# EAGLE schematic Tracker_V3 (EAGLE 9.6.2)
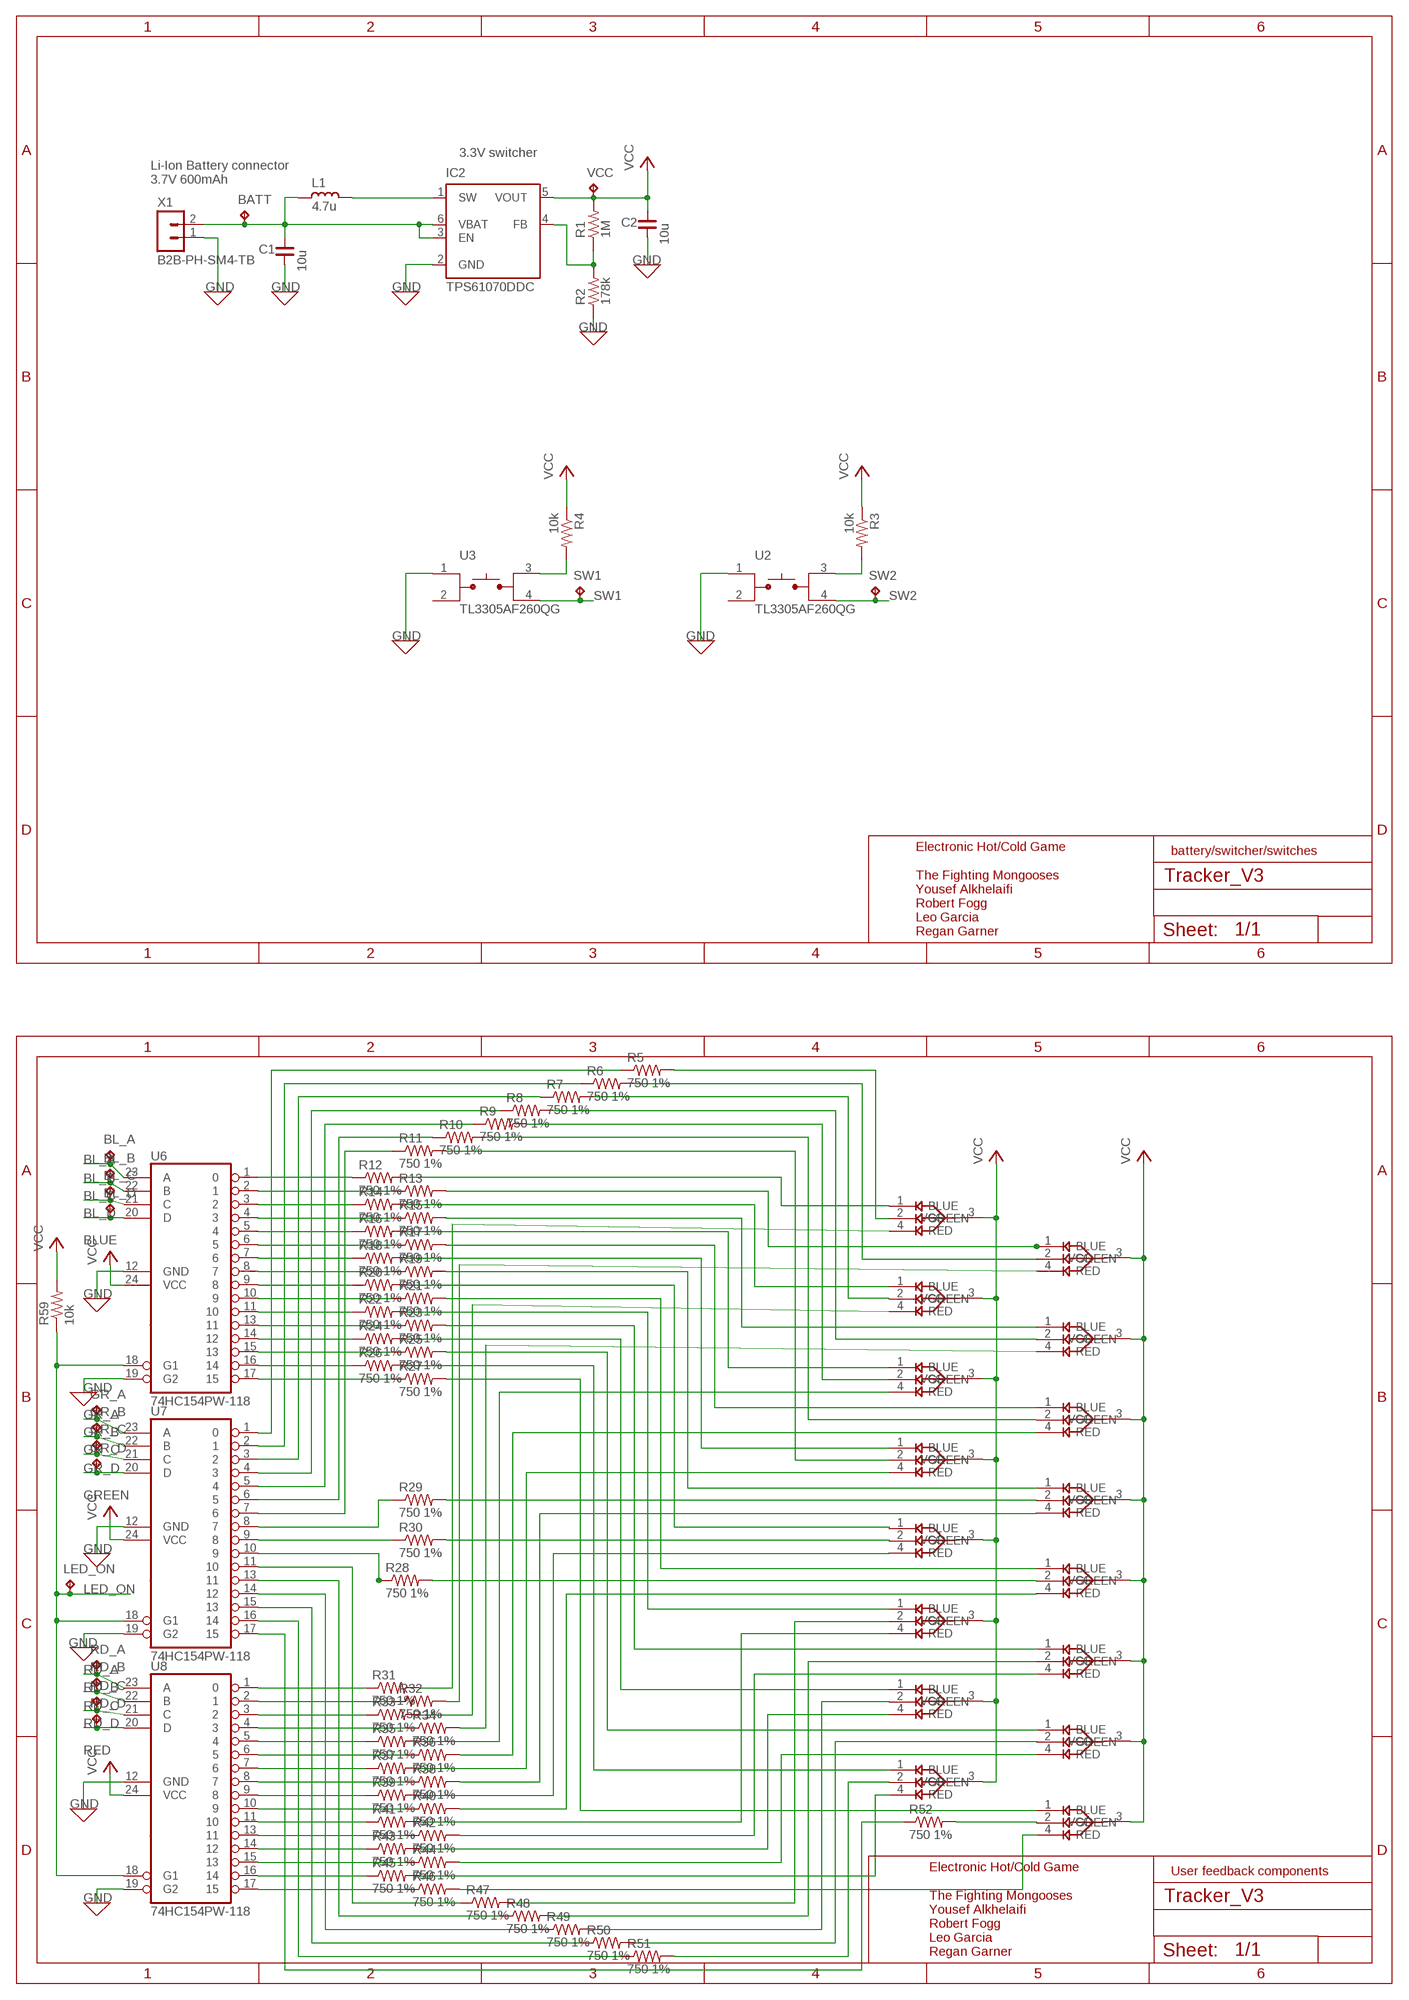
[diagram p0: schematic, sheet 1, part 1 of 2]
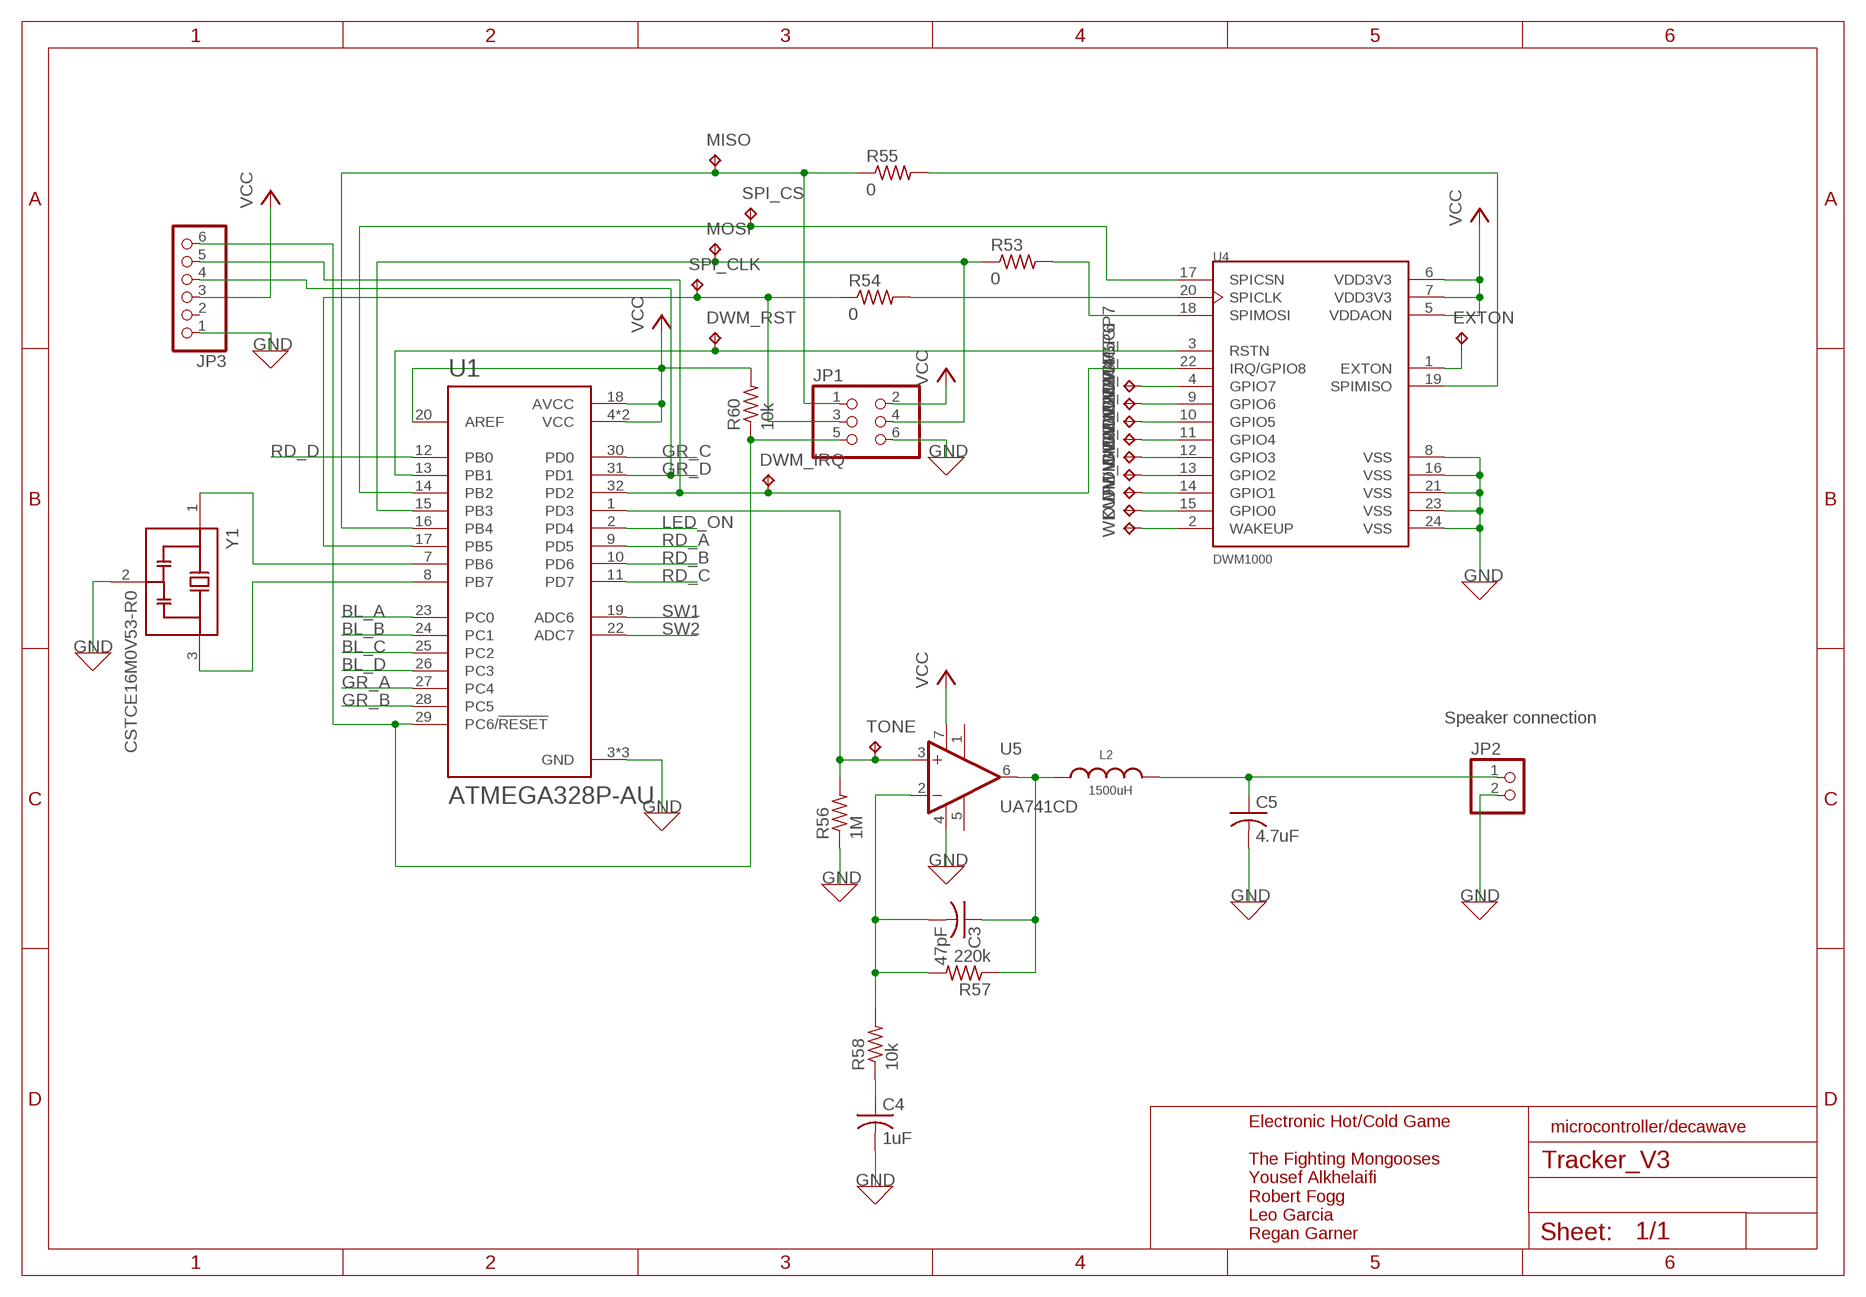
[diagram p1: schematic, sheet 1, part 2 of 2]

## Parts
BATT  TPB2,54  [B2,54]
BL_A  TPB2,54  [B2,54]
BL_B  TPB2,54  [B2,54]
BL_C  TPB2,54  [B2,54]
BL_D  TPB2,54  [B2,54]
C1  10u  C_0603  [C0603]
C2  10u  C_0603  [C0603]
C3  47pF  C-USC0402  [C0402]
C4  1uF  C-USC0402  [C0402]
C5  4.7uF  C-USC0402  [C0402]
D1  LED_EAST1616RGBA3  [LED_EAST1616RGBA3]
D2  LED_EAST1616RGBA3  [LED_EAST1616RGBA3]
D3  LED_EAST1616RGBA3  [LED_EAST1616RGBA3]
D4  LED_EAST1616RGBA3  [LED_EAST1616RGBA3]
D5  LED_EAST1616RGBA3  [LED_EAST1616RGBA3]
D6  LED_EAST1616RGBA3  [LED_EAST1616RGBA3]
D7  LED_EAST1616RGBA3  [LED_EAST1616RGBA3]
D8  LED_EAST1616RGBA3  [LED_EAST1616RGBA3]
D9  LED_EAST1616RGBA3  [LED_EAST1616RGBA3]
D10  LED_EAST1616RGBA3  [LED_EAST1616RGBA3]
D11  LED_EAST1616RGBA3  [LED_EAST1616RGBA3]
D12  LED_EAST1616RGBA3  [LED_EAST1616RGBA3]
D13  LED_EAST1616RGBA3  [LED_EAST1616RGBA3]
D14  LED_EAST1616RGBA3  [LED_EAST1616RGBA3]
D15  LED_EAST1616RGBA3  [LED_EAST1616RGBA3]
D16  LED_EAST1616RGBA3  [LED_EAST1616RGBA3]
DWM_GP0  TPB2,54  [B2,54]
DWM_GP1  TPB2,54  [B2,54]
DWM_GP2  TPB2,54  [B2,54]
DWM_GP3  TPB2,54  [B2,54]
DWM_GP4  TPB2,54  [B2,54]
DWM_GP5  TPB2,54  [B2,54]
DWM_GP6  TPB2,54  [B2,54]
DWM_GP7  TPB2,54  [B2,54]
DWM_IRQ  TPB2,54  [B2,54]
DWM_RST  TPB2,54  [B2,54]
EXTON  TPB2,54  [B2,54]
GR_A  TPB2,54  [B2,54]
GR_B  TPB2,54  [B2,54]
GR_C  TPB2,54  [B2,54]
GR_D  TPB2,54  [B2,54]
IC2  TPS61070DDC  [TSOT23-6_DDC]
JP1  PINHD-2X3  [2X03]
JP2  PINHD-1X2  [1X02]
JP3  PINHD-1X6  [1X06]
L1  4.7u  L_0603  [L0603]
L2  1500uH  WE-TPC_4828_744043152  [WE-TPC_4828]
LED_ON  TPB2,54  [B2,54]
MISO  TPB2,54  [B2,54]
MOSI  TPB2,54  [B2,54]
R1  1M  R_0603  [R0603]
R2  178k  R_0603  [R0603]
R3  10k  R-US_R0603  [R0603]
R4  10k  R-US_R0603  [R0603]
R5  750 1%  R-US_R0402  [R0402]
R6  750 1%  R-US_R0402  [R0402]
R7  750 1%  R-US_R0402  [R0402]
R8  750 1%  R-US_R0402  [R0402]
R9  750 1%  R-US_R0402  [R0402]
R10  750 1%  R-US_R0402  [R0402]
R11  750 1%  R-US_R0402  [R0402]
R12  750 1%  R-US_R0402  [R0402]
R13  750 1%  R-US_R0402  [R0402]
R14  750 1%  R-US_R0402  [R0402]
R15  750 1%  R-US_R0402  [R0402]
R16  750 1%  R-US_R0402  [R0402]
R17  750 1%  R-US_R0402  [R0402]
R18  750 1%  R-US_R0402  [R0402]
R19  750 1%  R-US_R0402  [R0402]
R20  750 1%  R-US_R0402  [R0402]
R21  750 1%  R-US_R0402  [R0402]
R22  750 1%  R-US_R0402  [R0402]
R23  750 1%  R-US_R0402  [R0402]
R24  750 1%  R-US_R0402  [R0402]
R25  750 1%  R-US_R0402  [R0402]
R26  750 1%  R-US_R0402  [R0402]
R27  750 1%  R-US_R0402  [R0402]
R28  750 1%  R-US_R0402  [R0402]
R29  750 1%  R-US_R0402  [R0402]
R30  750 1%  R-US_R0402  [R0402]
R31  750 1%  R-US_R0402  [R0402]
R32  750 1%  R-US_R0402  [R0402]
R33  750 1%  R-US_R0402  [R0402]
R34  750 1%  R-US_R0402  [R0402]
R35  750 1%  R-US_R0402  [R0402]
R36  750 1%  R-US_R0402  [R0402]
R37  750 1%  R-US_R0402  [R0402]
R38  750 1%  R-US_R0402  [R0402]
R39  750 1%  R-US_R0402  [R0402]
R40  750 1%  R-US_R0402  [R0402]
R41  750 1%  R-US_R0402  [R0402]
R42  750 1%  R-US_R0402  [R0402]
R43  750 1%  R-US_R0402  [R0402]
R44  750 1%  R-US_R0402  [R0402]
R45  750 1%  R-US_R0402  [R0402]
R46  750 1%  R-US_R0402  [R0402]
R47  750 1%  R-US_R0402  [R0402]
R48  750 1%  R-US_R0402  [R0402]
R49  750 1%  R-US_R0402  [R0402]
R50  750 1%  R-US_R0402  [R0402]
R51  750 1%  R-US_R0402  [R0402]
R52  750 1%  R-US_R0402  [R0402]
R53  0  R-US_R0402  [R0402]
R54  0  R-US_R0402  [R0402]
R55  0  R-US_R0402  [R0402]
R56  1M  R-US_R0603  [R0603]
R57  220k  R-US_R0603  [R0603]
R58  10k  R-US_R0603  [R0603]
R59  10k  R-US_R0603  [R0603]
R60  10k  R-US_R0603  [R0603]
RD_A  TPB2,54  [B2,54]
RD_B  TPB2,54  [B2,54]
RD_C  TPB2,54  [B2,54]
RD_D  TPB2,54  [B2,54]
SPI_CLK  TPB2,54  [B2,54]
SPI_CS  TPB2,54  [B2,54]
SW1  TPB2,54  [B2,54]
SW2  TPB2,54  [B2,54]
TONE  TPB2,54  [B2,54]
U1  ATMEGA328P-AU  [QFP80P900X900X120-32N]
U2  TL3305AF260QG  [SW_TL3305AF260QG]
U3  TL3305AF260QG  [SW_TL3305AF260QG]
U4  DWM1000  [XCVR_DWM1000]
U5  UA741CD  [SOIC127P600X175-8N]
U6  74HC154PW-118  [SOP65P640X110-24N]
U7  74HC154PW-118  [SOP65P640X110-24N]
U8  74HC154PW-118  [SOP65P640X110-24N]
VCC  TPB2,54  [B2,54]
WKUP  TPB2,54  [B2,54]
X1  B2B-PH-SM4-TB  [B2B-PH-SM4-TB]
Y1  CSTCE16M0V53-R0  [OSC_CSTCE16M0V53-R0]

## Nets
BL_A: BL_A.TP U1.23(PC0) U6.23(A)
BL_B: BL_B.TP U1.24(PC1) U6.22(B)
BL_C: BL_C.TP U1.25(PC2) U6.21(C)
BL_D: BL_D.TP U1.26(PC3) U6.20(D)
GND: C1.1 C2.1 C4.2 C5.2 IC2.2(GND) JP1.6 JP2.2 JP3.1 R2.1 R56.1 U1.3(GND) U1.5(GND) U1.21(GND) U2.1 U3.1 U4.8(VSS) U4.16(VSS) U4.21(VSS) U4.23(VSS) U4.24(VSS) U5.4(VCC-) U6.12(GND) U6.19(G2) U7.12(GND) U7.19(G2) U8.12(GND) U8.19(G2) X1.1 Y1.2(GND)
GR_A: GR_A.TP U1.27(PC4) U7.23(A)
GR_B: GR_B.TP U1.28(PC5) U7.22(B)
GR_C: GR_C.TP U1.30(PD0) U7.21(C)
GR_D: GR_D.TP JP3.4 U1.31(PD1) U7.20(D)
LED_ON: LED_ON.TP R59.1 U1.2(PD4) U6.18(G1) U7.18(G1) U8.18(G1)
N$1: IC2.1(SW) L1.1
N$2: BATT.TP C1.2 IC2.3(EN) IC2.6(VBAT) L1.2 X1.2
N$3: R4.2 U3.3
N$4: D1.1(BLUE) R12.2
N$5: R3.2 U2.3
N$6: IC2.4(FB) R1.1 R2.2
N$7: D7.1(BLUE) R18.2
N$8: D3.1(BLUE) R14.2
N$9: D4.1(BLUE) R15.2
N$10: D5.1(BLUE) R16.2
N$11: D6.1(BLUE) R17.2
N$12: D2.1(BLUE) R13.2
N$13: D8.1(BLUE) R19.2
N$14: D9.1(BLUE) R20.2
N$15: D10.1(BLUE) R21.2
N$16: D11.1(BLUE) R22.2
N$17: D12.1(BLUE) R23.2
N$18: D13.1(BLUE) R24.2
N$19: D14.1(BLUE) R25.2
N$20: D15.1(BLUE) R26.2
N$21: D16.1(BLUE) R27.2
N$22: R5.1 U7.1
N$23: R6.1 U7.2
N$24: R7.1 U7.3
N$25: D4.2(GREEN) R8.2
N$26: D5.2(GREEN) R9.2
N$27: D7.2(GREEN) R11.2
N$28: D6.2(GREEN) R10.2
N$29: D8.2(GREEN) R29.2
N$30: D9.2(GREEN) R30.2
N$31: R28.1 U7.10
N$32: D11.2(GREEN) R47.2
N$33: D12.2(GREEN) R48.2
N$34: R49.1 U7.14
N$35: R50.1 U7.15
N$36: R51.1 U7.16
N$37: R52.1 U7.17
N$38: D16.4(RED) R46.2
N$39: D15.4(RED) R45.2
N$40: D14.4(RED) R44.2
N$41: D13.4(RED) R43.2
N$42: D12.4(RED) R42.2
N$43: D11.4(RED) R41.2
N$44: D10.4(RED) R40.2
N$45: D9.4(RED) R39.2
N$46: D8.4(RED) R38.2
N$47: D7.4(RED) R37.2
N$48: D6.4(RED) R36.2
N$49: D5.4(RED) R35.2
N$50: D4.4(RED) R34.2
N$51: D3.4(RED) R33.2
N$52: D2.4(RED) R32.2
N$53: D1.4(RED) R31.2
N$54: D1.2(GREEN) R5.2
N$55: D2.2(GREEN) R6.2
N$56: D3.2(GREEN) R7.2
N$57: R8.1 U7.4
N$58: R9.1 U7.5
N$59: R10.1 U7.6
N$60: R11.1 U7.7
N$61: R12.1 U6.1
N$62: R13.1 U6.2
N$63: R14.1 U6.3
N$64: R15.1 U6.4
N$65: R16.1 U6.5
N$66: R17.1 U6.6
N$67: R18.1 U6.7
N$68: R19.1 U6.8
N$69: R20.1 U6.9
N$70: R21.1 U6.10
N$71: R22.1 U6.11
N$72: R23.1 U6.13
N$73: R24.1 U6.14
N$74: R25.1 U6.15
N$75: R26.1 U6.16
N$76: R27.1 U6.17
N$77: R29.1 U7.8
N$78: R30.1 U7.9
N$79: D10.2(GREEN) R28.2
N$80: R31.1 U8.1
N$81: R32.1 U8.2
N$82: R33.1 U8.3
N$83: R34.1 U8.4
N$84: R35.1 U8.5
N$85: R36.1 U8.6
N$86: R37.1 U8.7
N$87: R38.1 U8.8
N$88: R39.1 U8.9
N$89: R40.1 U8.10
N$90: R41.1 U8.11
N$91: R42.1 U8.13
N$92: R43.1 U8.14
N$93: R44.1 U8.15
N$94: R45.1 U8.16
N$95: R46.1 U8.17
N$96: R47.1 U7.11
N$97: R48.1 U7.13
N$98: D13.2(GREEN) R49.2
N$99: D14.2(GREEN) R50.2
N$100: D15.2(GREEN) R51.2
N$101: D16.2(GREEN) R52.2
N$102: SPI_CS.TP U1.14(PB2) U4.17(SPICSN)
N$103: JP1.4 MOSI.TP R53.1 U1.15(PB3)
N$104: JP1.1 MISO.TP R55.1 U1.16(PB4)
N$105: JP1.3 R54.1 SPI_CLK.TP U1.17(PB5)
N$106: DWM_RST.TP U1.13(PB1) U4.3(RSTN)
N$107: DWM_IRQ.TP JP3.5 U1.32(PD2) U4.22(IRQ/GPIO8)
N$108: U1.8(PB7) Y1.3(OUT)
N$109: U1.7(PB6) Y1.1(IN)
N$110: JP1.5 JP3.6 R60.1 U1.29(PC6/!RESET)
N$111: R53.2 U4.18(SPIMOSI)
N$112: R54.2 U4.20(SPICLK)
N$113: R55.2 U4.19(SPIMISO)
N$114: R56.2 TONE.TP U1.1(PD3) U5.3(NON-INVERTING_INPUT)
N$115: C3.1 L2.1 R57.1 U5.6(OUTPUT)
N$116: C5.1 JP2.1 L2.2
N$117: C3.2 R57.2 R58.2 U5.2(INVERTING_INPUT)
N$118: C4.1 R58.1
N$119: DWM_GP7.TP U4.4(GPIO7)
N$120: DWM_GP6.TP U4.9(GPIO6)
N$121: DWM_GP5.TP U4.10(GPIO5)
N$122: DWM_GP4.TP U4.11(GPIO4)
N$123: DWM_GP3.TP U4.12(GPIO3)
N$124: DWM_GP2.TP U4.13(GPIO2)
N$125: DWM_GP1.TP U4.14(GPIO1)
N$126: DWM_GP0.TP U4.15(GPIO0)
N$127: U4.2(WAKEUP) WKUP.TP
N$128: EXTON.TP U4.1(EXTON)
RD_A: RD_A.TP U1.9(PD5) U8.23(A)
RD_B: RD_B.TP U1.10(PD6) U8.22(B)
RD_C: RD_C.TP U1.11(PD7) U8.21(C)
RD_D: RD_D.TP U1.12(PB0) U8.20(D)
SW1: SW1.TP U1.19(ADC6) U3.4
SW2: SW2.TP U1.22(ADC7) U2.4
VCC: C2.2 D1.3(VCC) D2.3(VCC) D3.3(VCC) D4.3(VCC) D5.3(VCC) D6.3(VCC) D7.3(VCC) D8.3(VCC) D9.3(VCC) D10.3(VCC) D11.3(VCC) D12.3(VCC) D13.3(VCC) D14.3(VCC) D15.3(VCC) D16.3(VCC) IC2.5(VOUT) JP1.2 JP3.3 R1.2 R3.1 R4.1 R59.2 R60.2 U1.4(VCC) U1.6(VCC) U1.18(AVCC) U1.20(AREF) U4.5(VDDAON) U4.6(VDD3V3) U4.7(VDD3V3) U5.7(VCC+) U6.24(VCC) U7.24(VCC) U8.24(VCC) VCC.TP
Unconnected: JP3.2 U2.2 U3.2 U5.1(OFFSET_NULL_1) U5.5(OFFSET_NULL_2)

## Notes on the sheet
- 3.3V switcher
- Li-Ion Battery connector
  3.7V 600mAh
- Speaker connection
- battery/switcher/switches | microcontroller/decawave
- Electronic Hot/Cold Game
  
  The Fighting Mongooses
  Yousef Alkhelaifi
  Robert Fogg
  Leo Garcia
  Regan Garner
- Electronic Hot/Cold Game
  
  The Fighting Mongooses
  Yousef Alkhelaifi
  Robert Fogg
  Leo Garcia
  Regan Garner
- BLUE
- GREEN
- RED
- User feedback components
- Electronic Hot/Cold Game
  
  The Fighting Mongooses
  Yousef Alkhelaifi
  Robert Fogg
  Leo Garcia
  Regan Garner

## Library data of the parts
BATT BL_A BL_B BL_C BL_D DWM_GP0 DWM_GP1-DWM_GP7 DWM_IRQ DWM_RST EXTON GR_A GR_B GR_C GR_D LED_ON MISO MOSI RD_A RD_B RD_C RD_D SPI_CLK SPI_CS SW1 SW2 TONE VCC WKUP = testpad:TP: Test pad
C1 C2 = rc-master-smd:C_: NON-POLARIZED CAP; C1: 10uF
C3-C5 = rcl:C-US: CAPACITOR, American symbol; SPICEPREFIX: C
D1-D16 = LED_EAST1616RGBA3:LED_EAST1616RGBA3: 0606 5mA LED RGB
IC2 = texas:TPS6107*: 90% EFFICIENT SYNCHRONOUS BOOST CONVERTER WITH 600-mA SWITCH Source: http://focus.ti.com/lit/ds/symlink/tps61070.pdf; MPN: TPS61070DDCR; OC_FARNELL: 1461062; OC_NEWARK: 64M3125
JP1 = pinhead:PINHD-2X3: PIN HEADER
JP2 = pinhead:PINHD-1X2: PIN HEADER
JP3 = pinhead:PINHD-1X6: PIN HEADER
L1 = rc-master-smd:L_: INDUCTOR; L1: 4.7uH
L2 = Eagle_WE-TPC_rev19a:WE-TPC_4828: WE-TPC SMD Tiny Power Inductor Characteristics Extremely flat power inductor High current capability Magnetically shielded which results in a low leakage field Recommended solder profile: Reflow Operating temperature: –40 °C to +125 °C Applications Portable power like PDA, digital camera, PCMCIA cards and displays DC/DC converter Embedded PC Mobile data gathering, telemetric <https://katalog.we-online.com/media/images/v2/o14870v209%20WE-TPC_Gruppe_2.jpg> Details see: https://katalog.we-online.com/en/pbs/WE-TPC Updated by Yingchun,Shan 2019-07-18 2019(C) Wurth Elektronik; DATASHEET-URL: https://katalog.we-online.com/pbs/datasheet/744043152.pdf; FRES: 2MHz; IR: 0.09A; ISAT: 0.05A; PART-NUMBER: 744043152; RDC-MAX: 9000mOhm; RDC-TYP: 6800mOhm
R1 R2 = rc-master-smd:R_: RESISTOR
R3-R55 = resistor:R-US_: RESISTOR, American symbol
R56-R60 = rcl:R-US_: RESISTOR, American symbol; SPICEPREFIX: R
U1 = ATMEGA328P-AU:ATMEGA328P-AU: ATmega Series 20 MHz 32 KB Flash 2 KB SRAM 8-Bit Microcontroller - TQFP-32 Check prices <https://pricing.snapeda.com/parts/ATMEGA328P-AU/Microchip%20Technology/view-part?ref=eda>; AVAILABILITY: Good; DESCRIPTION: AVR AVR® ATmega Microcontroller IC 8-Bit 20MHz 32KB (16K x 16) FLASH 32-TQFP (7x7); MF: Microchip Technology; MP: ATMEGA328P-AU; PACKAGE: TQFP-32 Microchip Technology; PRICE: None; PURCHASE-URL: https://pricing.snapeda.com/search/part/ATMEGA328P-AU/?ref=eda
U2 U3 = TL3305AF260QG:TL3305AF260QG: Switch Tactile Spst-No 50ma 12v Check prices <https://pricing.snapeda.com/parts/TL3305AF260QG/E-Switch/view-part?ref=eda>; AVAILABILITY: Warning; DESCRIPTION: Tactile Switch SPST-NO Top Actuated Surface Mount; MF: E-Switch; MP: TL3305AF260QG; PACKAGE: LQFP-48 E-Switch; PRICE: None; PURCHASE-URL: https://pricing.snapeda.com/search/part/TL3305AF260QG/?ref=eda
U4 = DWM1000:DWM1000: Mod Ieee802.15.4-2011 Uwb Txrx Check prices <https://pricing.snapeda.com/parts/DWM1000/Decawave%20Limited/view-part?ref=eda>; AVAILABILITY: Warning; DESCRIPTION: 802.15.4 IR-UWB Transceiver Module 3.5GHz ~ 6.5GHz Integrated, Chip Surface Mount; MF: Decawave Limited; MP: DWM1000; PACKAGE: Module Decawave; PRICE: None; PURCHASE-URL: https://pricing.snapeda.com/search/part/DWM1000/?ref=eda
U5 = UA741CD:UA741CD: Semiconductors and Actives, integrated Check prices <https://pricing.snapeda.com/parts/UA741CD/STMicroelectronics/view-part?ref=eda>; AVAILABILITY: Good; DESCRIPTION: General Purpose Amplifier 1 Circuit 8-SO; MF: STMicroelectronics; MP: UA741CD; PACKAGE: SOIC-8 STMicroelectronics; PRICE: None; PURCHASE-URL: https://pricing.snapeda.com/search/part/UA741CD/?ref=eda
U6-U8 = 74HC154PW-118:74HC154PW-118
X1 = con-JST PH:B2B-PH: JST PH series header 2.00mm pitch disconnectable crimp style connectors, vertical (side entry type), 2 pins
Y1 = CSTCE16M0V53-R0:CSTCE16M0V53-R0: Ceramic Resonator 16MHz ??0.5% (Tol) ??0.3% (Stability) 15pF 40Ohm 3-Pin CSMD T/R Check prices <https://pricing.snapeda.com/parts/CSTCE16M0V53-R0/Murata/view-part?ref=eda>; AVAILABILITY: Bad; DESCRIPTION: 16MHz Ceramic Resonator Built in Capacitor 15pF ±0.3% -20°C ~ 80°C Surface Mount; MF: Murata; MP: CSTCE16M0V53-R0; PACKAGE: SMD-3 Murata; PRICE: None